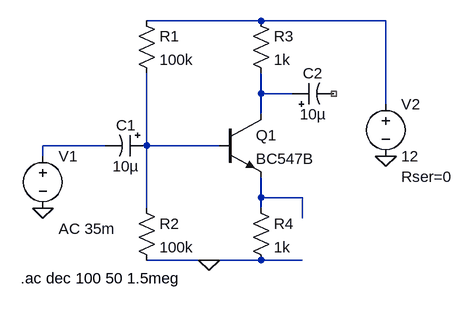
[diagram p0: schematic dev.asc]
dev.asc, the LTspice schematic file:
Version 4
SHEET 1 880 680
WIRE 432 -80 256 -80
WIRE 624 -80 432 -80
WIRE 432 32 432 0
WIRE 480 32 432 32
WIRE 624 48 624 -80
WIRE 432 64 432 32
WIRE 192 112 96 112
WIRE 256 112 256 0
WIRE 368 112 256 112
WIRE 96 128 96 112
WIRE 432 192 432 160
WIRE 496 192 432 192
WIRE 256 208 256 112
WIRE 432 208 432 192
WIRE 496 224 496 192
WIRE 352 288 256 288
WIRE 432 288 352 288
WIRE 496 288 432 288
FLAG 352 288 0
FLAG 624 128 0
FLAG 96 208 0
SYMBOL voltage 96 112 R0
WINDOW 123 24 128 Left 2
WINDOW 39 0 0 Left 2
SYMATTR InstName V1
SYMATTR Value ""
SYMATTR Value2 AC 35m
SYMBOL polcap 256 96 R90
WINDOW 0 0 32 VBottom 2
WINDOW 3 32 32 VTop 2
SYMATTR InstName C1
SYMATTR Value 10µ
SYMBOL res 240 -96 R0
SYMATTR InstName R1
SYMATTR Value 100k
SYMBOL res 240 192 R0
SYMATTR InstName R2
SYMATTR Value 100k
SYMBOL npn 368 64 R0
SYMATTR InstName Q1
SYMATTR Value BC547B
SYMBOL res 416 -96 R0
SYMATTR InstName R3
SYMATTR Value 1k
SYMBOL polcap 480 48 R270
WINDOW 0 32 32 VTop 2
WINDOW 3 0 32 VBottom 2
SYMATTR InstName C2
SYMATTR Value 10µ
SYMBOL res 416 192 R0
SYMATTR InstName R4
SYMATTR Value 1k
SYMBOL voltage 624 32 R0
WINDOW 123 0 0 Left 2
WINDOW 39 24 128 Left 2
SYMATTR InstName V2
SYMATTR Value 12
SYMATTR SpiceLine Rser=0
TEXT 62 316 Left 2 !.ac dec 100 50 1.5meg

The netlist it stands for:
* dev.asc
V1 N003 0 AC 35m
C1 N004 N003 10µ
R1 N001 N004 100k
R2 N004 0 100k
Q1 N002 N004 N005 0 BC547B
R3 N001 N002 1k
C2 N002 NC_01 10µ
R4 N005 0 1k
V2 N001 0 12 Rser=0
.model NPN NPN
.model PNP PNP
.lib standard.bjt
.ac dec 100 50 1.5meg
.backanno
.end